# EAGLE design TheRug (EAGLE 7.7.0)
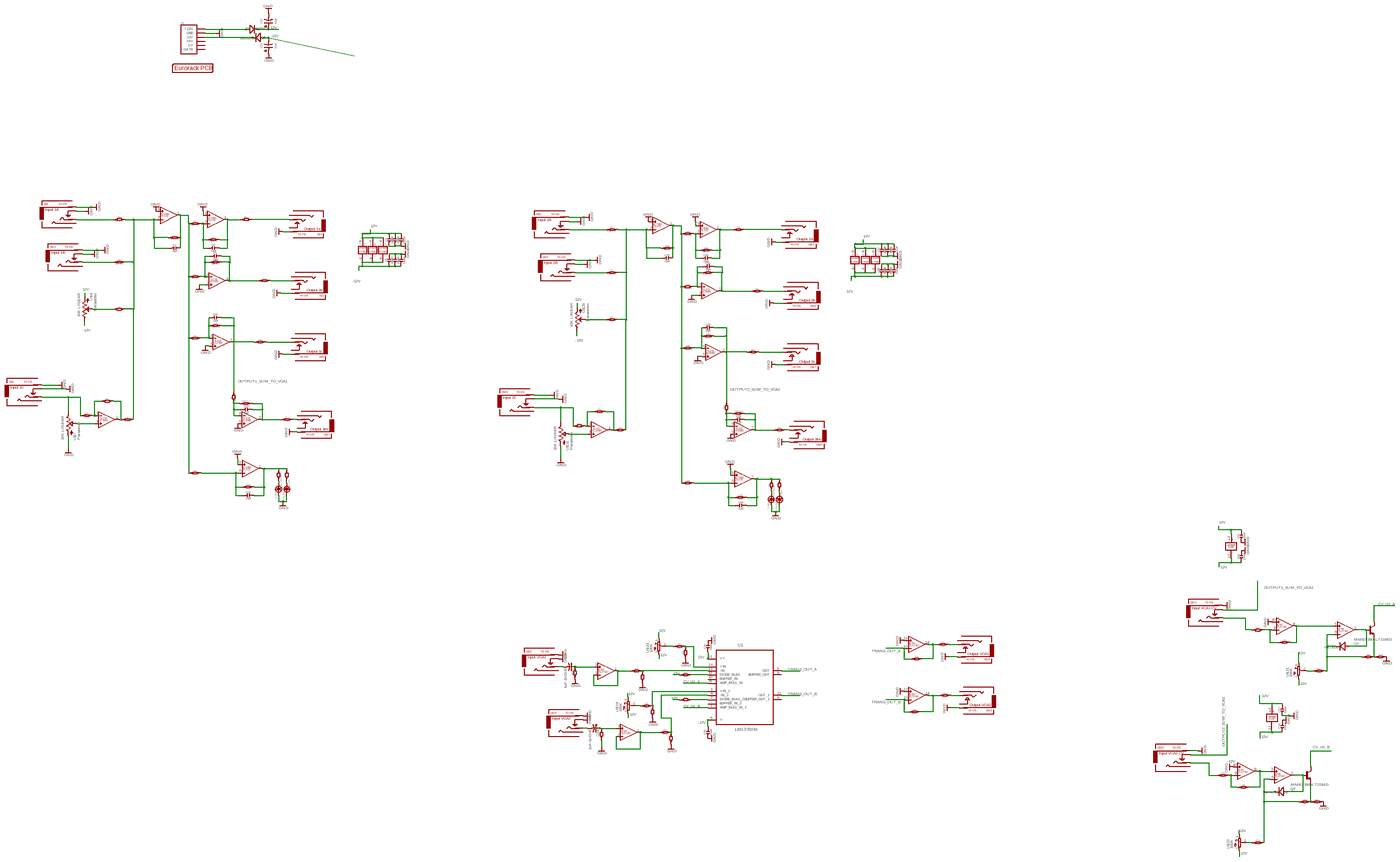
[diagram p0: schematic, sheet 1, overview]
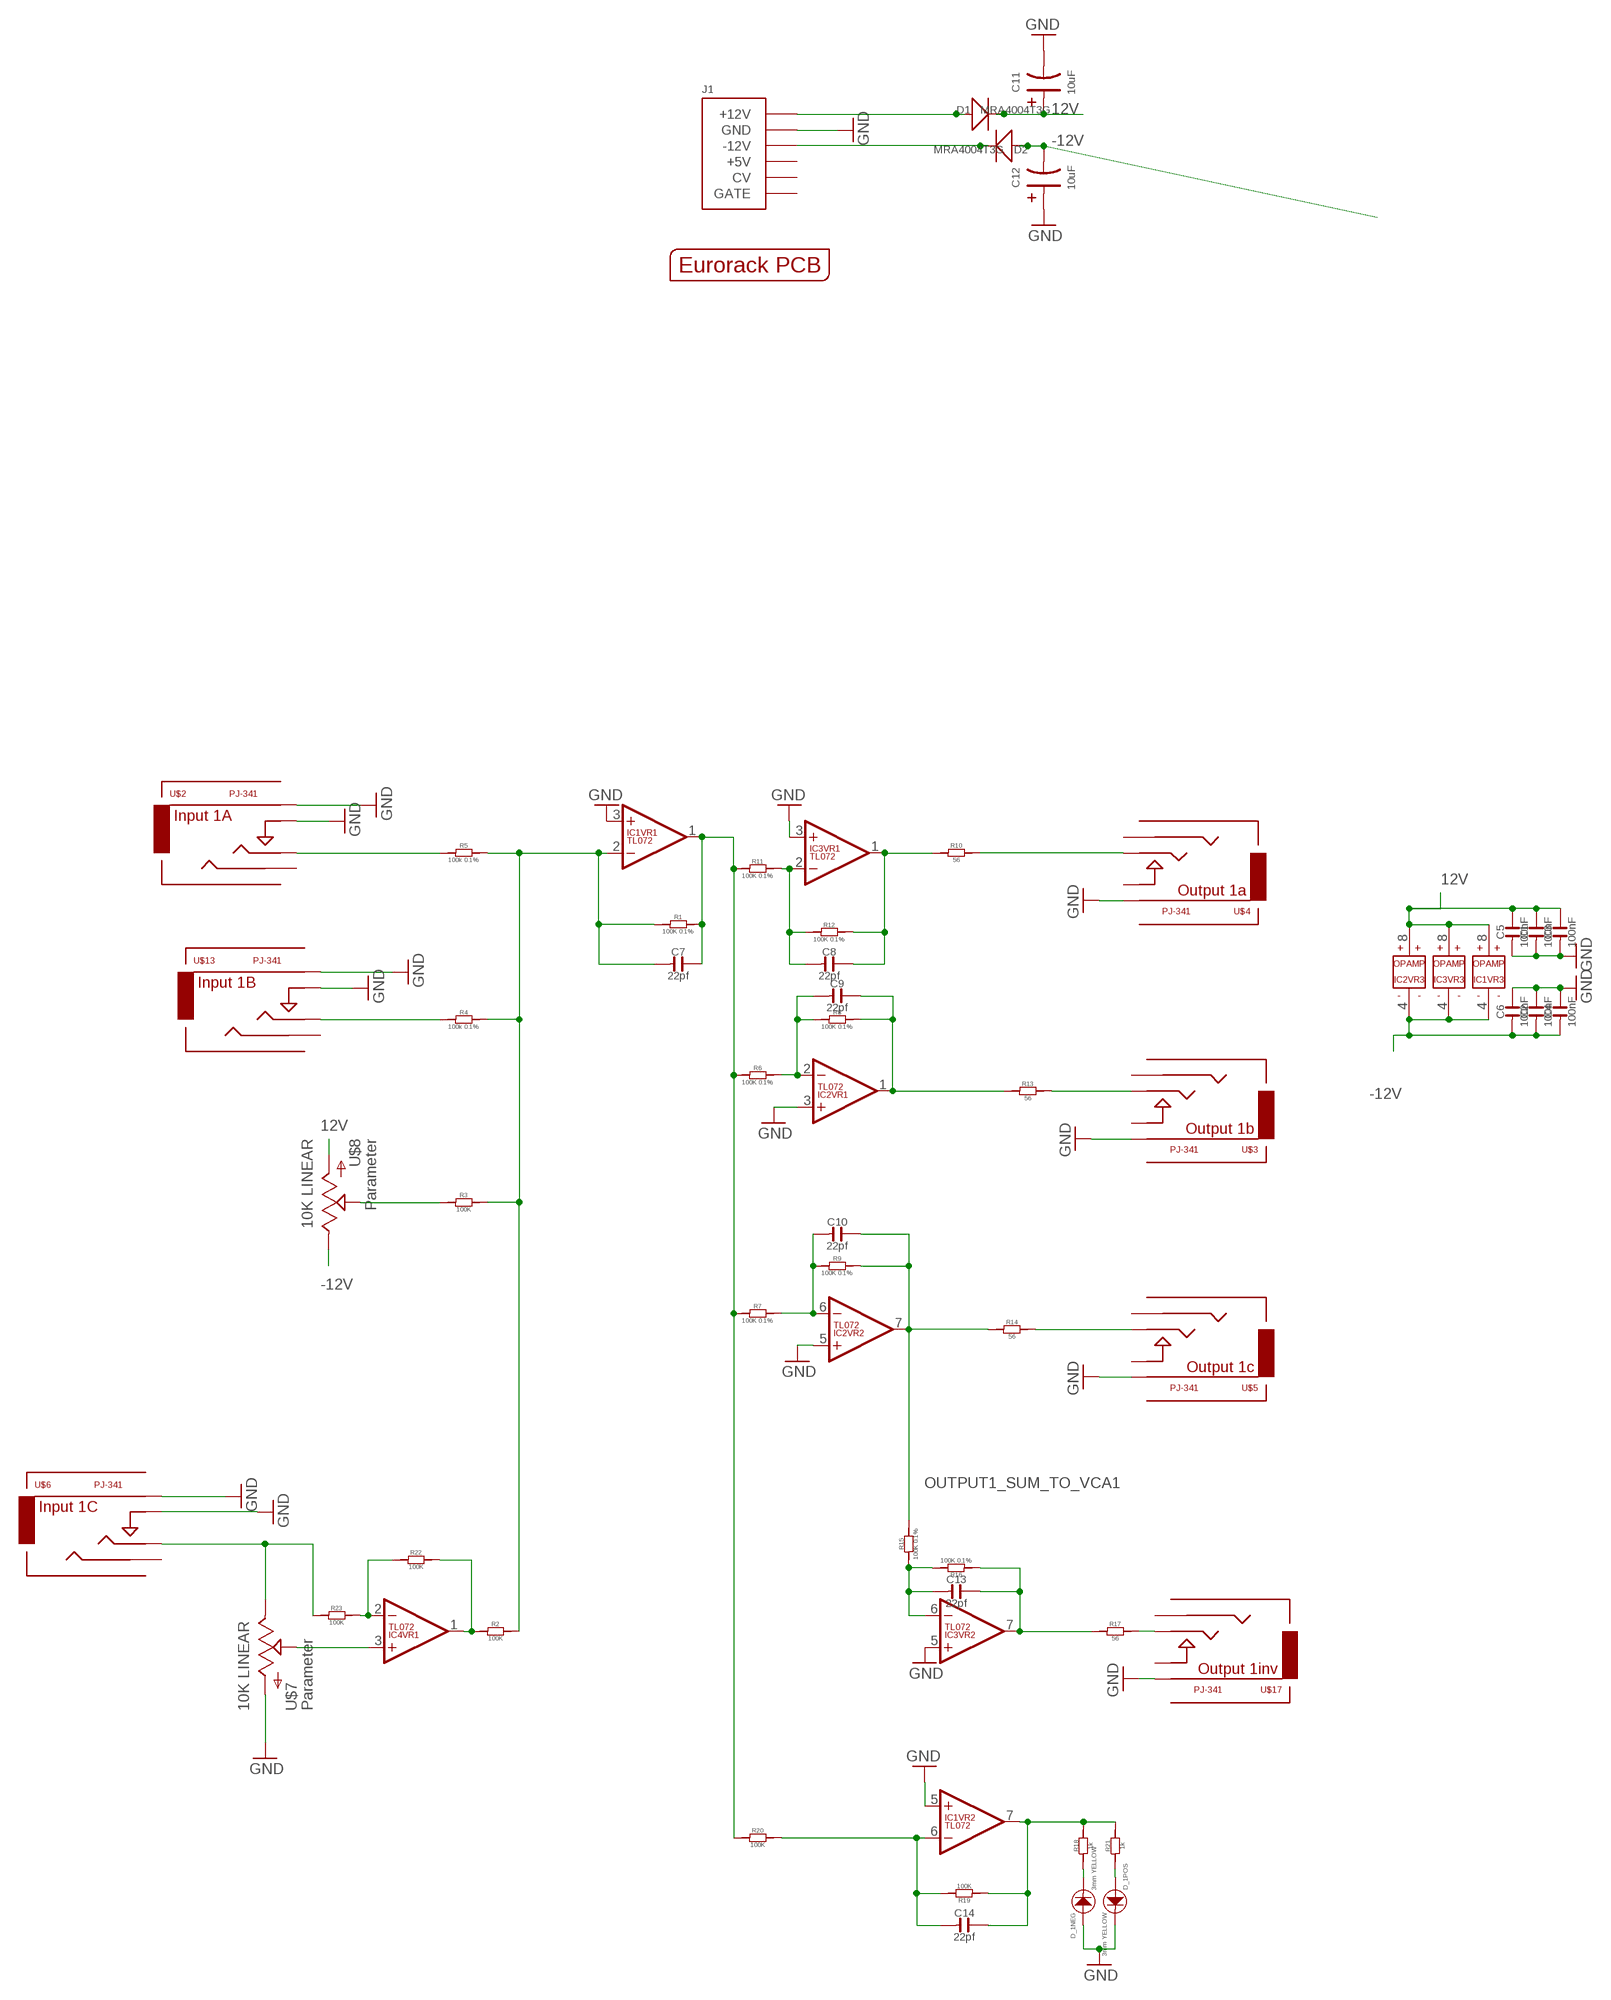
[diagram p1: schematic, sheet 1, part 1 of 4]
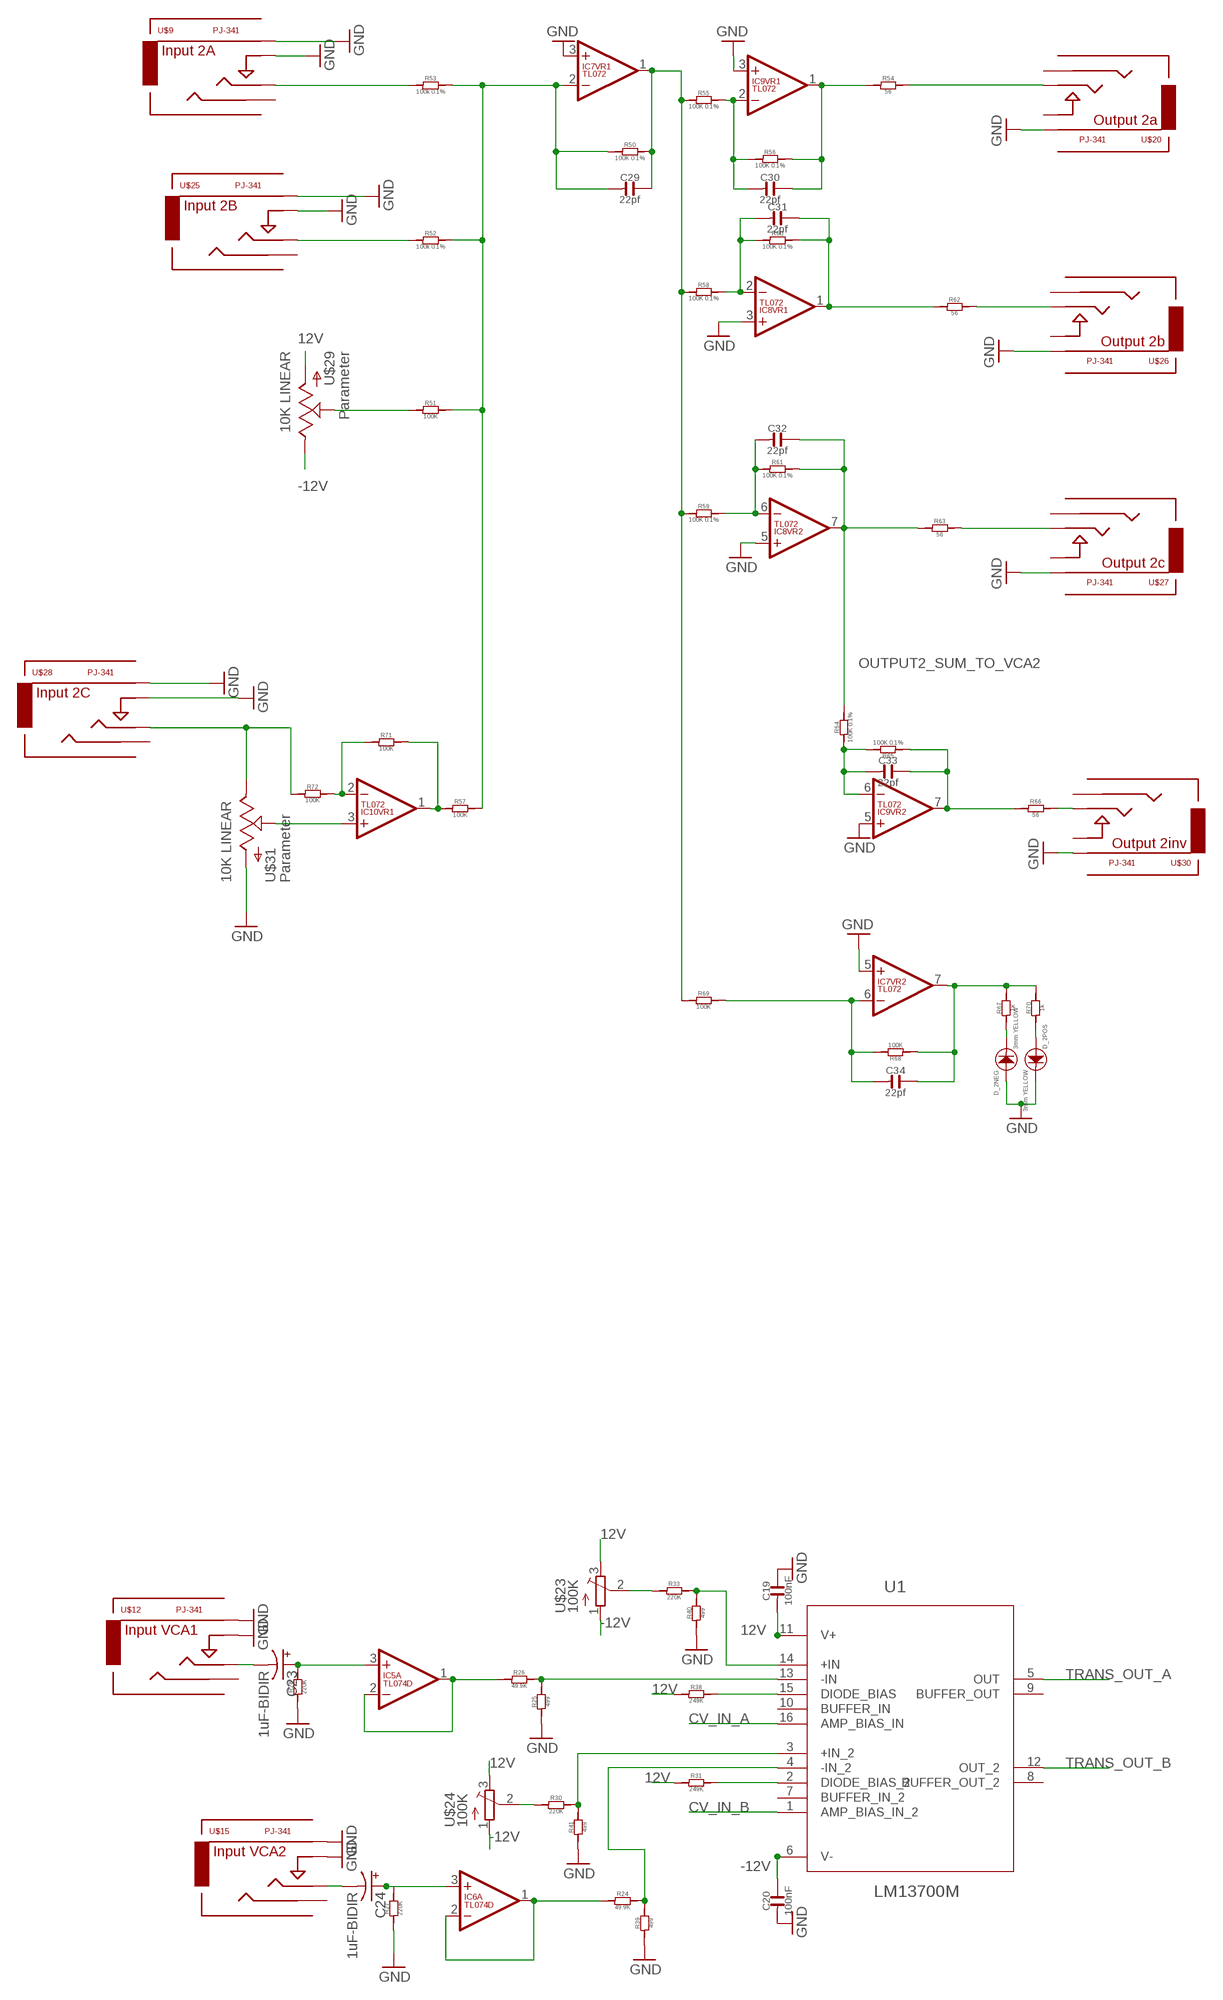
[diagram p2: schematic, sheet 1, part 2 of 4]
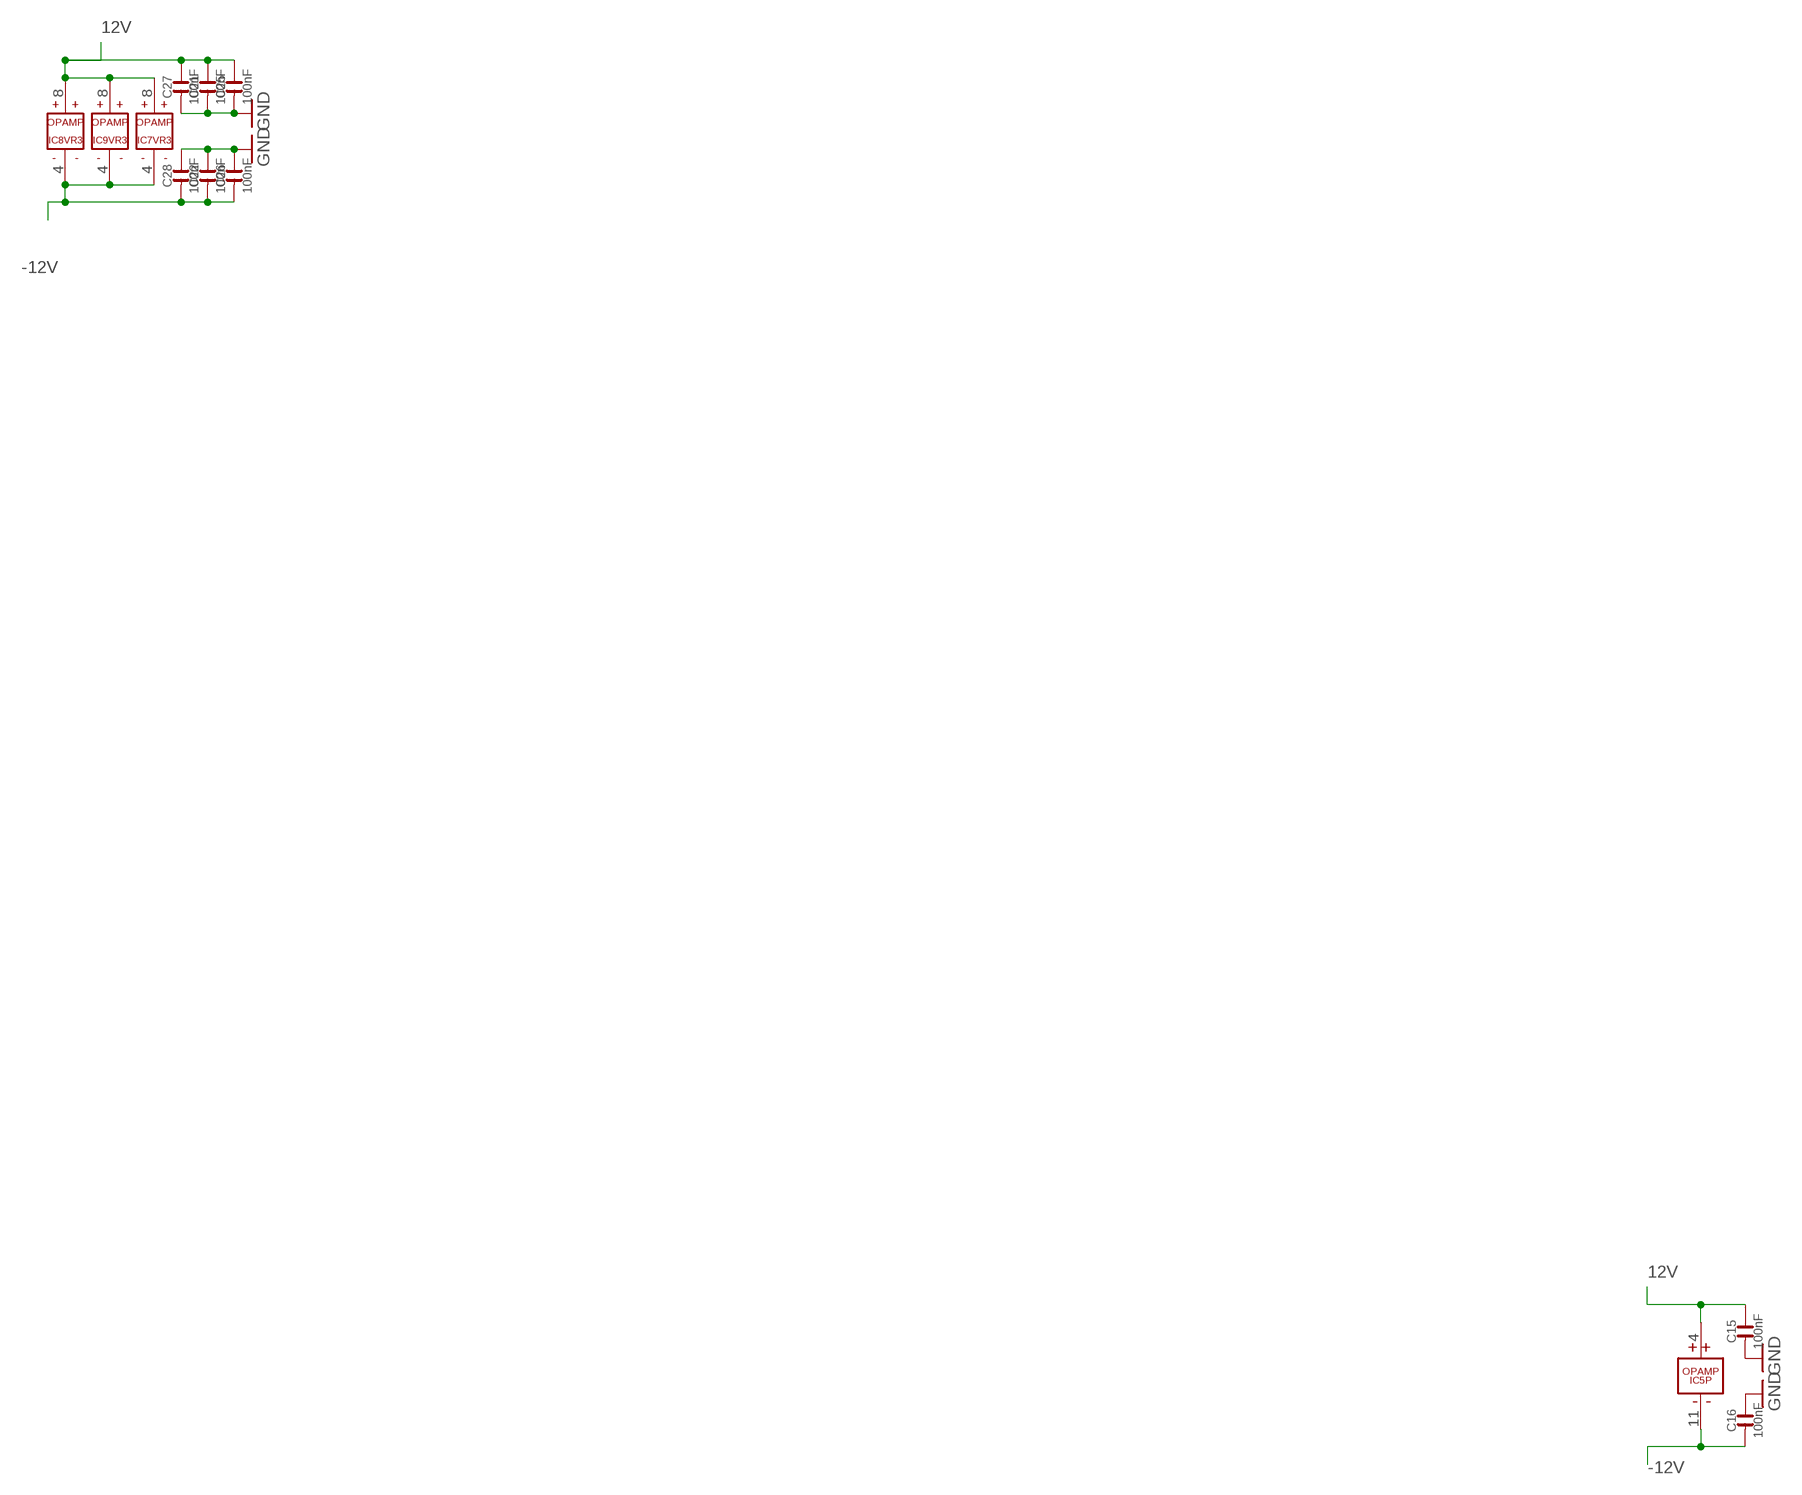
[diagram p3: schematic, sheet 1, part 3 of 4]
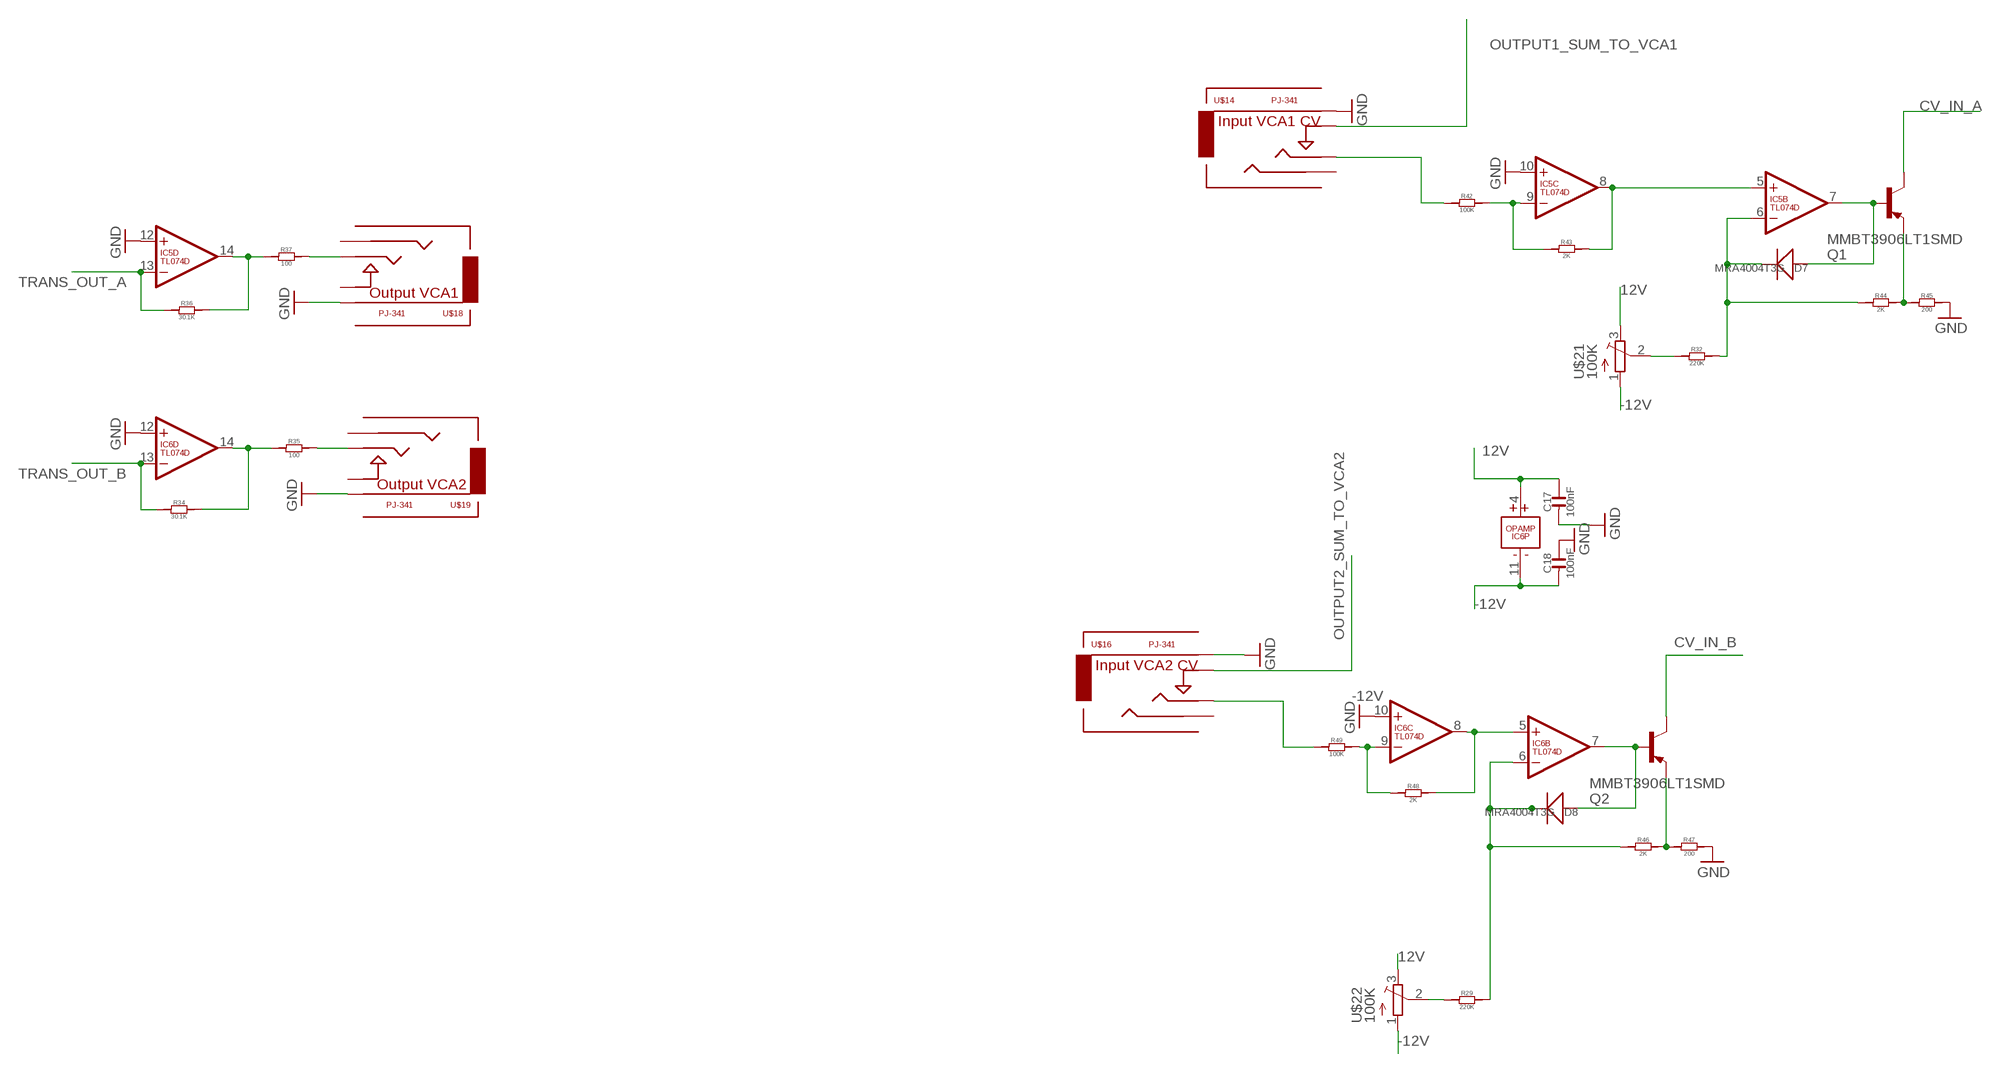
[diagram p4: schematic, sheet 1, part 4 of 4]

## Parts
C1  100nF  C-0603  [C0603]
C2  100nF  C-0603  [C0603]
C3  100nF  C-0603  [C0603]
C4  100nF  C-0603  [C0603]
C5  100nF  C-0603  [C0603]
C6  100nF  C-0603  [C0603]
C7  22pf  C-0603  [C0603]
C8  22pf  C-0603  [C0603]
C9  22pf  C-0603  [C0603]
C10  22pf  C-0603  [C0603]
C11  10uF  C-POLAR-A  [CASE-A_3216]
C12  10uF  C-POLAR-A  [CASE-A_3216]
C13  22pf  C-0603  [C0603]
C14  22pf  C-0603  [C0603]
C15  100nF  C-0603  [C0603]
C16  100nF  C-0603  [C0603]
C17  100nF  C-0603  [C0603]
C18  100nF  C-0603  [C0603]
C19  100nF  C-0603  [C0603]
C20  100nF  C-0603  [C0603]
C21  100nF  C-0603  [C0603]
C22  100nF  C-0603  [C0603]
C23  1uF-BIDIR  CPOL-US153CLV-0505  [153CLV-0505]
C24  1uF-BIDIR  CPOL-US153CLV-0505  [153CLV-0505]
C25  100nF  C-0603  [C0603]
C26  100nF  C-0603  [C0603]
C27  100nF  C-0603  [C0603]
C28  100nF  C-0603  [C0603]
C29  22pf  C-0603  [C0603]
C30  22pf  C-0603  [C0603]
C31  22pf  C-0603  [C0603]
C32  22pf  C-0603  [C0603]
C33  22pf  C-0603  [C0603]
C34  22pf  C-0603  [C0603]
D1  MRA4004T3G  D-SMA  [DO-214AC]
D2  MRA4004T3G  D-SMA  [DO-214AC]
D7  MRA4004T3G  D-SMA  [DO-214AC]
D8  MRA4004T3G  D-SMA  [DO-214AC]
D_1NEG  3mm YELLOW  LED3MM  [3MMLED]
D_1POS  3mm YELLOW  LED3MM  [3MMLED]
D_2NEG  3mm YELLOW  LED3MM  [3MMLED]
D_2POS  3mm YELLOW  LED3MM  [3MMLED]
IC1  TL072  [SO08]
IC2  TL072  [SO08]
IC3  TL072  [SO08]
IC4  TL072  [SO08]
IC5  TL074D  [SO14]
IC6  TL074D  [SO14]
IC7  TL072  [SO08]
IC8  TL072  [SO08]
IC9  TL072  [SO08]
IC10  TL072  [SO08]
J1  POWERSHROUDED  [POWER_16_SHROUDED]
Q1  MMBT3906LT1SMD  [SOT23-BEC]
Q2  MMBT3906LT1SMD  [SOT23-BEC]
R1  100K 0.1%  R-0603  [R0603]
R2  100K  R-0603  [R0603]
R3  100K  R-0603  [R0603]
R4  100k 0.1%  R-0603  [R0603]
R5  100k 0.1%  R-0603  [R0603]
R6  100K 0.1%  R-0603  [R0603]
R7  100K 0.1%  R-0603  [R0603]
R8  100K 0.1%  R-0603  [R0603]
R9  100K 0.1%  R-0603  [R0603]
R10  56  R-0603  [R0603]
R11  100K 0.1%  R-0603  [R0603]
R12  100K 0.1%  R-0603  [R0603]
R13  56  R-0603  [R0603]
R14  56  R-0603  [R0603]
R15  100K 0.1%  R-0603  [R0603]
R16  100K 0.1%  R-0603  [R0603]
R17  56  R-0603  [R0603]
R18  1k  R-0603  [R0603]
R19  100K  R-0603  [R0603]
R20  100K  R-0603  [R0603]
R21  1k  R-0603  [R0603]
R22  100K  R-0603  [R0603]
R23  100K  R-0603  [R0603]
R24  49.9K  R  [C0805]
R25  499  R  [C0805]
R26  49.9K  R  [C0805]
R27  220K  R  [C0805]
R28  220K  R  [C0805]
R29  220K  R  [C0805]
R30  220K  R  [C0805]
R31  249K  R  [C0805]
R32  220K  R  [C0805]
R33  220K  R  [C0805]
R34  30.1K  R  [C0805]
R35  100  R  [C0805]
R36  30.1K  R  [C0805]
R37  100  R  [C0805]
R38  249K  R  [C0805]
R39  499  R  [C0805]
R40  499  R  [C0805]
R41  499  R  [C0805]
R42  100K  R  [C0805]
R43  2K  R  [C0805]
R44  2K  R  [C0805]
R45  200  R  [C0805]
R46  2K  R  [C0805]
R47  200  R  [C0805]
R48  2K  R  [C0805]
R49  100K  R  [C0805]
R50  100K 0.1%  R-0603  [R0603]
R51  100K  R-0603  [R0603]
R52  100k 0.1%  R-0603  [R0603]
R53  100k 0.1%  R-0603  [R0603]
R54  56  R-0603  [R0603]
R55  100K 0.1%  R-0603  [R0603]
R56  100K 0.1%  R-0603  [R0603]
R57  100K  R-0603  [R0603]
R58  100K 0.1%  R-0603  [R0603]
R59  100K 0.1%  R-0603  [R0603]
R60  100K 0.1%  R-0603  [R0603]
R61  100K 0.1%  R-0603  [R0603]
R62  56  R-0603  [R0603]
R63  56  R-0603  [R0603]
R64  100K 0.1%  R-0603  [R0603]
R65  100K 0.1%  R-0603  [R0603]
R66  56  R-0603  [R0603]
R67  1k  R-0603  [R0603]
R68  100K  R-0603  [R0603]
R69  100K  R-0603  [R0603]
R70  1k  R-0603  [R0603]
R71  100K  R-0603  [R0603]
R72  100K  R-0603  [R0603]
U1  LM13700M  [SOIC127P620X175-16N]
U$1  EURORACK_PCB12HP  [EURORACK12HPPCB]
U$2  PJ-341  AUDIO-JACKINPUT  [3.5MM-JACK-SWITCH-13MM-INPUT]
U$3  PJ-341  AUDIO-JACKOUTPUT  [3.5MM-JACK-SWITCH-13MM-OUTPUT]
U$4  PJ-341  AUDIO-JACKOUTPUT  [3.5MM-JACK-SWITCH-13MM-OUTPUT]
U$5  PJ-341  AUDIO-JACKOUTPUT  [3.5MM-JACK-SWITCH-13MM-OUTPUT]
U$6  PJ-341  AUDIO-JACKINPUT  [3.5MM-JACK-SWITCH-13MM-INPUT]
U$7  10K LINEAR  POTZEPHPOT  [OG-POTS_ALPS_POT_VERTICAL]
U$8  10K LINEAR  POTZEPHPOT  [OG-POTS_ALPS_POT_VERTICAL]
U$9  PJ-341  AUDIO-JACKINPUT  [3.5MM-JACK-SWITCH-13MM-INPUT]
U$12  PJ-341  AUDIO-JACKINPUT  [3.5MM-JACK-SWITCH-13MM-INPUT]
U$13  PJ-341  AUDIO-JACKINPUT  [3.5MM-JACK-SWITCH-13MM-INPUT]
U$14  PJ-341  AUDIO-JACKINPUT  [3.5MM-JACK-SWITCH-13MM-INPUT]
U$15  PJ-341  AUDIO-JACKINPUT  [3.5MM-JACK-SWITCH-13MM-INPUT]
U$16  PJ-341  AUDIO-JACKINPUT  [3.5MM-JACK-SWITCH-13MM-INPUT]
U$17  PJ-341  AUDIO-JACKOUTPUT  [3.5MM-JACK-SWITCH-13MM-OUTPUT]
U$18  PJ-341  AUDIO-JACKOUTPUT  [3.5MM-JACK-SWITCH-13MM-OUTPUT]
U$19  PJ-341  AUDIO-JACKOUTPUT  [3.5MM-JACK-SWITCH-13MM-OUTPUT]
U$20  PJ-341  AUDIO-JACKOUTPUT  [3.5MM-JACK-SWITCH-13MM-OUTPUT]
U$21  100K  TRIMPOTTC33X  [TC33X]
U$22  100K  TRIMPOTTC33X  [TC33X]
U$23  100K  TRIMPOTTC33X  [TC33X]
U$24  100K  TRIMPOTTC33X  [TC33X]
U$25  PJ-341  AUDIO-JACKINPUT  [3.5MM-JACK-SWITCH-13MM-INPUT]
U$26  PJ-341  AUDIO-JACKOUTPUT  [3.5MM-JACK-SWITCH-13MM-OUTPUT]
U$27  PJ-341  AUDIO-JACKOUTPUT  [3.5MM-JACK-SWITCH-13MM-OUTPUT]
U$28  PJ-341  AUDIO-JACKINPUT  [3.5MM-JACK-SWITCH-13MM-INPUT]
U$29  10K LINEAR  POTZEPHPOT  [OG-POTS_ALPS_POT_VERTICAL]
U$30  PJ-341  AUDIO-JACKOUTPUT  [3.5MM-JACK-SWITCH-13MM-OUTPUT]
U$31  10K LINEAR  POTZEPHPOT  [OG-POTS_ALPS_POT_VERTICAL]

## Nets
12V: C1.2 C3.2 C5.2 C11.+ C15.2 C17.2 C19.1 C21.2 C25.2 C27.2 D1.2(-) IC1.8(VR3:V+) IC2.8(VR3:V+) IC3.8(VR3:V+) IC5.4(P:V+) IC6.4(P:V+) IC7.8(VR3:V+) IC8.8(VR3:V+) IC9.8(VR3:V+) R31.1 R38.1 U1.11(V+) U$8.P$3(A) U$21.3(E) U$22.3(E) U$23.3(E) U$24.3(E) U$29.P$3(A)
-12V: C2.1 C4.1 C6.1 C12.- C16.1 C18.1 C20.2 C22.1 C26.1 C28.1 D2.1(+) IC1.4(VR3:V-) IC2.4(VR3:V-) IC3.4(VR3:V-) IC5.11(P:V-) IC6.11(P:V-) IC7.4(VR3:V-) IC8.4(VR3:V-) IC9.4(VR3:V-) U1.6(V-) U$8.P$1(E) U$21.1(A) U$22.1(A) U$23.1(A) U$24.1(A) U$29.P$1(E)
CV_IN_A: Q1.C U1.16(AMP_BIAS_IN)
CV_IN_B: Q2.C U1.1(AMP_BIAS_IN_2)
GND: C1.1 C2.2 C3.1 C4.2 C5.1 C6.2 C11.- C12.+ C15.1 C16.2 C17.1 C18.2 C19.2 C20.1 C21.1 C22.2 C25.1 C26.2 C27.1 C28.2 D_1NEG.+ D_1POS.- D_2NEG.+ D_2POS.- IC1.3(VR1:+IN) IC1.5(VR2:+IN) IC2.3(VR1:+IN) IC2.5(VR2:+IN) IC3.3(VR1:+IN) IC3.5(VR2:+IN) IC5.10(C:+IN) IC5.12(D:+IN) IC6.10(C:+IN) IC6.12(D:+IN) IC7.3(VR1:+IN) IC7.5(VR2:+IN) IC8.3(VR1:+IN) IC8.5(VR2:+IN) IC9.3(VR1:+IN) IC9.5(VR2:+IN) J1.3(GND) J1.4(GND) J1.5(GND) J1.6(GND) J1.7(GND) J1.8(GND) R25.1 R27.1 R28.1 R39.1 R40.1 R41.1 R45.2 R47.2 U$2.RING@3(RING) U$2.SWITCH@3(SWITCH) U$3.RING@3(RING) U$4.RING@3(RING) U$5.RING@3(RING) U$6.RING@3(RING) U$6.SWITCH@3(SWITCH) U$7.P$3(A) U$9.RING@3(RING) U$9.SWITCH@3(SWITCH) U$12.RING@3(RING) U$12.SWITCH@3(SWITCH) U$13.RING@3(RING) U$13.SWITCH@3(SWITCH) U$14.RING@3(RING) U$15.RING@3(RING) U$15.SWITCH@3(SWITCH) U$16.RING@3(RING) U$17.RING@3(RING) U$18.RING@3(RING) U$19.RING@3(RING) U$20.RING@3(RING) U$25.RING@3(RING) U$25.SWITCH@3(SWITCH) U$26.RING@3(RING) U$27.RING@3(RING) U$28.RING@3(RING) U$28.SWITCH@3(SWITCH) U$30.RING@3(RING) U$31.P$3(A)
N$1: IC4.3(VR1:+IN) U$7.P$2(S)
N$2: C8.2 IC3.1(VR1:OUT) R10.1 R12.2
N$3: IC4.1(VR1:OUT) R2.1 R22.2
N$4: R23.1 U$6.TIP@3(TIP) U$7.P$1(E)
N$5: C9.1 IC2.2(VR1:-IN) R6.2 R8.1
N$6: R3.1 U$8.P$2(S)
N$7: C7.2 IC1.1(VR1:OUT) R1.2 R6.1 R7.1 R11.1 R20.1
N$8: C8.1 IC3.2(VR1:-IN) R11.2 R12.1
N$9: C10.1 IC2.6(VR2:-IN) R7.2 R9.1
N$10: IC4.2(VR1:-IN) R22.1 R23.2
N$11: C9.2 IC2.1(VR1:OUT) R8.2 R13.1
N$12: R4.1 U$13.TIP@3(TIP)
N$14: C7.1 IC1.2(VR1:-IN) R1.1 R2.2 R3.2 R4.2 R5.2
N$15: R13.2 U$3.TIP@3(TIP)
N$16: R14.2 U$5.TIP@3(TIP)
N$17: C13.1 IC3.6(VR2:-IN) R15.1 R16.2
N$18: C13.2 IC3.7(VR2:OUT) R16.1 R17.1
N$19: R17.2 U$17.TIP@3(TIP)
N$20: R5.1 U$2.TIP@3(TIP)
N$21: D_1POS.+ R21.1
N$22: R10.2 U$4.TIP@3(TIP)
N$23: D_1NEG.- R18.1
N$24: C14.2 IC1.7(VR2:OUT) R18.2 R19.1 R21.2
N$25: C14.1 IC1.6(VR2:-IN) R19.2 R20.2
N$26: R37.2 U$18.TIP@3(TIP)
N$27: IC5.14(D:OUT) R36.2 R37.1
N$28 [heavypower]: D1.1(+) J1.9(+12V) J1.10(+12V)
N$29: R31.2 U1.2(DIODE_BIAS_2)
N$30: R38.2 U1.15(DIODE_BIAS)
N$31: R35.2 U$19.TIP@3(TIP)
N$32: IC6.14(D:OUT) R34.2 R35.1
N$33: R33.1 U$23.2(S)
N$34: R32.1 U$21.2(S)
N$35: R30.1 U$24.2(S)
N$36: R29.1 U$22.2(S)
N$37: C23.- U$12.TIP@3(TIP)
N$38: C24.- U$15.TIP@3(TIP)
N$39: C23.+ IC5.3(A:+IN) R28.2
N$40: C24.+ IC6.3(A:+IN) R27.2
N$41: IC5.1(A:OUT) IC5.2(A:-IN) R26.1
N$42: IC6.1(A:OUT) IC6.2(A:-IN) R24.1
N$43: R25.2 R26.2 U1.13(-IN)
N$44: R24.2 R39.2 U1.4(-IN_2)
N$45: R33.2 R40.2 U1.14(+IN)
N$46: R30.2 R41.2 U1.3(+IN_2)
N$47: R49.1 U$16.TIP@3(TIP)
N$48: R42.1 U$14.TIP@3(TIP)
N$50: IC5.9(C:-IN) R42.2 R43.1
N$51: IC5.5(B:+IN) IC5.8(C:OUT) R43.2
N$52: D7.2(-) IC5.6(B:-IN) R32.2 R44.1
N$53: C30.2 IC9.1(VR1:OUT) R54.1 R56.2
N$54: R51.1 U$29.P$2(S)
N$55: D7.1(+) IC5.7(B:OUT) Q1.B
N$56: Q1.E R44.2 R45.1
N$57: D8.2(-) IC6.6(B:-IN) R29.2 R46.1
N$58: D8.1(+) IC6.7(B:OUT) Q2.B
N$59: Q2.E R46.2 R47.1
N$60: IC6.5(B:+IN) IC6.8(C:OUT) R48.2
N$62: IC6.9(C:-IN) R48.1 R49.2
N$63: R52.1 U$25.TIP@3(TIP)
N$64 [heavypower]: D2.2(-) J1.1(-12V) J1.2(-12V)
N$65: C29.1 IC7.2(VR1:-IN) R50.1 R51.2 R52.2 R53.2 R57.2
N$66: R54.2 U$20.TIP@3(TIP)
N$67: C29.2 IC7.1(VR1:OUT) R50.2 R55.1 R58.1 R59.1 R69.1
N$68: C30.1 IC9.2(VR1:-IN) R55.2 R56.1
N$69: R53.1 U$9.TIP@3(TIP)
N$70: R72.1 U$28.TIP@3(TIP) U$31.P$1(E)
N$71: C31.1 IC8.2(VR1:-IN) R58.2 R60.1
N$72: C32.1 IC8.6(VR2:-IN) R59.2 R61.1
N$73: C31.2 IC8.1(VR1:OUT) R60.2 R62.1
N$75: R62.2 U$26.TIP@3(TIP)
N$76: R63.2 U$27.TIP@3(TIP)
N$77: C33.1 IC9.6(VR2:-IN) R64.1 R65.2
N$78: C33.2 IC9.7(VR2:OUT) R65.1 R66.1
N$79: R66.2 U$30.TIP@3(TIP)
N$80: D_2NEG.- R67.1
N$81: C34.2 IC7.7(VR2:OUT) R67.2 R68.1 R70.2
N$82: C34.1 IC7.6(VR2:-IN) R68.2 R69.2
N$83: D_2POS.+ R70.1
N$84: IC10.3(VR1:+IN) U$31.P$2(S)
N$85: IC10.1(VR1:OUT) R57.1 R71.2
N$86: IC10.2(VR1:-IN) R71.1 R72.2
OUTPUT1_SUM_TO_VCA1: C10.2 IC2.7(VR2:OUT) R9.2 R14.1 R15.2 U$14.SWITCH@3(SWITCH)
OUTPUT2_SUM_TO_VCA2: C32.2 IC8.7(VR2:OUT) R61.2 R63.1 R64.2 U$16.SWITCH@3(SWITCH)
TRANS_OUT_A: IC5.13(D:-IN) R36.1 U1.5(OUT)
TRANS_OUT_B: IC6.13(D:-IN) R34.1 U1.12(OUT_2)
Unconnected: IC4.5(VR2:+IN) IC4.6(VR2:-IN) IC4.7(VR2:OUT) IC10.5(VR2:+IN) IC10.6(VR2:-IN) IC10.7(VR2:OUT) J1.11(+5V) J1.12(+5V) J1.13(CV) J1.14(CV) J1.15(GATE) J1.16(GATE) U1.7(BUFFER_IN_2) U1.8(BUFFER_OUT_2) U1.9(BUFFER_OUT) U1.10(BUFFER_IN) U$2.SECOND@3(SECOND) U$3.SECOND@3(SECOND) U$3.SWITCH@3(SWITCH) U$4.SECOND@3(SECOND) U$4.SWITCH@3(SWITCH) U$5.SECOND@3(SECOND) U$5.SWITCH@3(SWITCH) U$6.SECOND@3(SECOND) U$9.SECOND@3(SECOND) U$12.SECOND@3(SECOND) U$13.SECOND@3(SECOND) U$14.SECOND@3(SECOND) U$15.SECOND@3(SECOND) U$16.SECOND@3(SECOND) U$17.SECOND@3(SECOND) U$17.SWITCH@3(SWITCH) U$18.SECOND@3(SECOND) U$18.SWITCH@3(SWITCH) U$19.SECOND@3(SECOND) U$19.SWITCH@3(SWITCH) U$20.SECOND@3(SECOND) U$20.SWITCH@3(SWITCH) U$25.SECOND@3(SECOND) U$26.SECOND@3(SECOND) U$26.SWITCH@3(SWITCH) U$27.SECOND@3(SECOND) U$27.SWITCH@3(SWITCH) U$28.SECOND@3(SECOND) U$30.SECOND@3(SECOND) U$30.SWITCH@3(SWITCH)

## Power pins joined to a net without a drawn wire
V+: IC4.8(VR3:V+) IC10.8(VR3:V+)
V-: IC4.4(VR3:V-) IC10.4(VR3:V-)

## Library data of the parts
C1-C10 C13-C22 C25-C34 = OPL:C*
C11 C12 = EurorackModularParts:C-POLAR*
C23 C24 = adafruit:CPOL-US: POLARIZED CAPACITOR, American symbol
D1 D2 D7 D8 = OPL:D*: DIODE; MF: VISHAY; MPN: US1G-E3/5AT; OC_FARNELL: 9551824
D_1NEG D_1POS D_2NEG D_2POS = EurorackModularParts:LED*: LED
IC1-IC4 IC7-IC10 = EurorackModularParts:TL072
IC5 IC6 = EurorackModularParts:TL074: OP AMP
J1 = EurorackModularParts:POWER
Q1 Q2 = transistor-pnp:MMBT3906*: PNP Transistror
R1-R72 = OPL:R*
U1 = FarnellThings:LM13700M: Dual Operational Transconductance Amplifiers; MPN: LM13700M; OC_FARNELL: 1468910; OC_NEWARK: 41K3505; PACKAGE: SOIC-16; SUPPLIER: National Semiconductor
U$1 = EurorackModularParts:EURORACK_PCB
U$2 = EurorackModularParts:AUDIO-JACK: Switching Mono 3.5mm Audio Jack from Erthenvar.; DESC: Input 1A; MPN: PJ-341
U$3 = EurorackModularParts:AUDIO-JACK: Switching Mono 3.5mm Audio Jack from Erthenvar.; DESC: Output 1b; MPN: PJ-341
U$4 = EurorackModularParts:AUDIO-JACK: Switching Mono 3.5mm Audio Jack from Erthenvar.; DESC: Output 1a; MPN: PJ-341
U$5 = EurorackModularParts:AUDIO-JACK: Switching Mono 3.5mm Audio Jack from Erthenvar.; DESC: Output 1c; MPN: PJ-341
U$6 = EurorackModularParts:AUDIO-JACK: Switching Mono 3.5mm Audio Jack from Erthenvar.; DESC: Input 1C; MPN: PJ-341
U$7 U$8 U$29 U$31 = EurorackModularParts:POT; DESC: Parameter
U$9 = EurorackModularParts:AUDIO-JACK: Switching Mono 3.5mm Audio Jack from Erthenvar.; DESC: Input 2A; MPN: PJ-341
U$12 = EurorackModularParts:AUDIO-JACK: Switching Mono 3.5mm Audio Jack from Erthenvar.; DESC: Input VCA1; MPN: PJ-341
U$13 = EurorackModularParts:AUDIO-JACK: Switching Mono 3.5mm Audio Jack from Erthenvar.; DESC: Input 1B; MPN: PJ-341
U$14 = EurorackModularParts:AUDIO-JACK: Switching Mono 3.5mm Audio Jack from Erthenvar.; DESC: Input VCA1 CV; MPN: PJ-341
U$15 = EurorackModularParts:AUDIO-JACK: Switching Mono 3.5mm Audio Jack from Erthenvar.; DESC: Input VCA2; MPN: PJ-341
U$16 = EurorackModularParts:AUDIO-JACK: Switching Mono 3.5mm Audio Jack from Erthenvar.; DESC: Input VCA2 CV; MPN: PJ-341
U$17 = EurorackModularParts:AUDIO-JACK: Switching Mono 3.5mm Audio Jack from Erthenvar.; DESC: Output 1inv; MPN: PJ-341
U$18 = EurorackModularParts:AUDIO-JACK: Switching Mono 3.5mm Audio Jack from Erthenvar.; DESC: Output VCA1; MPN: PJ-341
U$19 = EurorackModularParts:AUDIO-JACK: Switching Mono 3.5mm Audio Jack from Erthenvar.; DESC: Output VCA2; MPN: PJ-341
U$20 = EurorackModularParts:AUDIO-JACK: Switching Mono 3.5mm Audio Jack from Erthenvar.; DESC: Output 2a; MPN: PJ-341
U$21-U$24 = adafruit:TRIMPOT: SMT trimmer potentiometer part number TC33X http://www.ladyada.net/library/eagle
U$25 = EurorackModularParts:AUDIO-JACK: Switching Mono 3.5mm Audio Jack from Erthenvar.; DESC: Input 2B; MPN: PJ-341
U$26 = EurorackModularParts:AUDIO-JACK: Switching Mono 3.5mm Audio Jack from Erthenvar.; DESC: Output 2b; MPN: PJ-341
U$27 = EurorackModularParts:AUDIO-JACK: Switching Mono 3.5mm Audio Jack from Erthenvar.; DESC: Output 2c; MPN: PJ-341
U$28 = EurorackModularParts:AUDIO-JACK: Switching Mono 3.5mm Audio Jack from Erthenvar.; DESC: Input 2C; MPN: PJ-341
U$30 = EurorackModularParts:AUDIO-JACK: Switching Mono 3.5mm Audio Jack from Erthenvar.; DESC: Output 2inv; MPN: PJ-341

## Net classes
0 default: width 0.254 mm
1 heavypower: width 0.381 mm

## Board
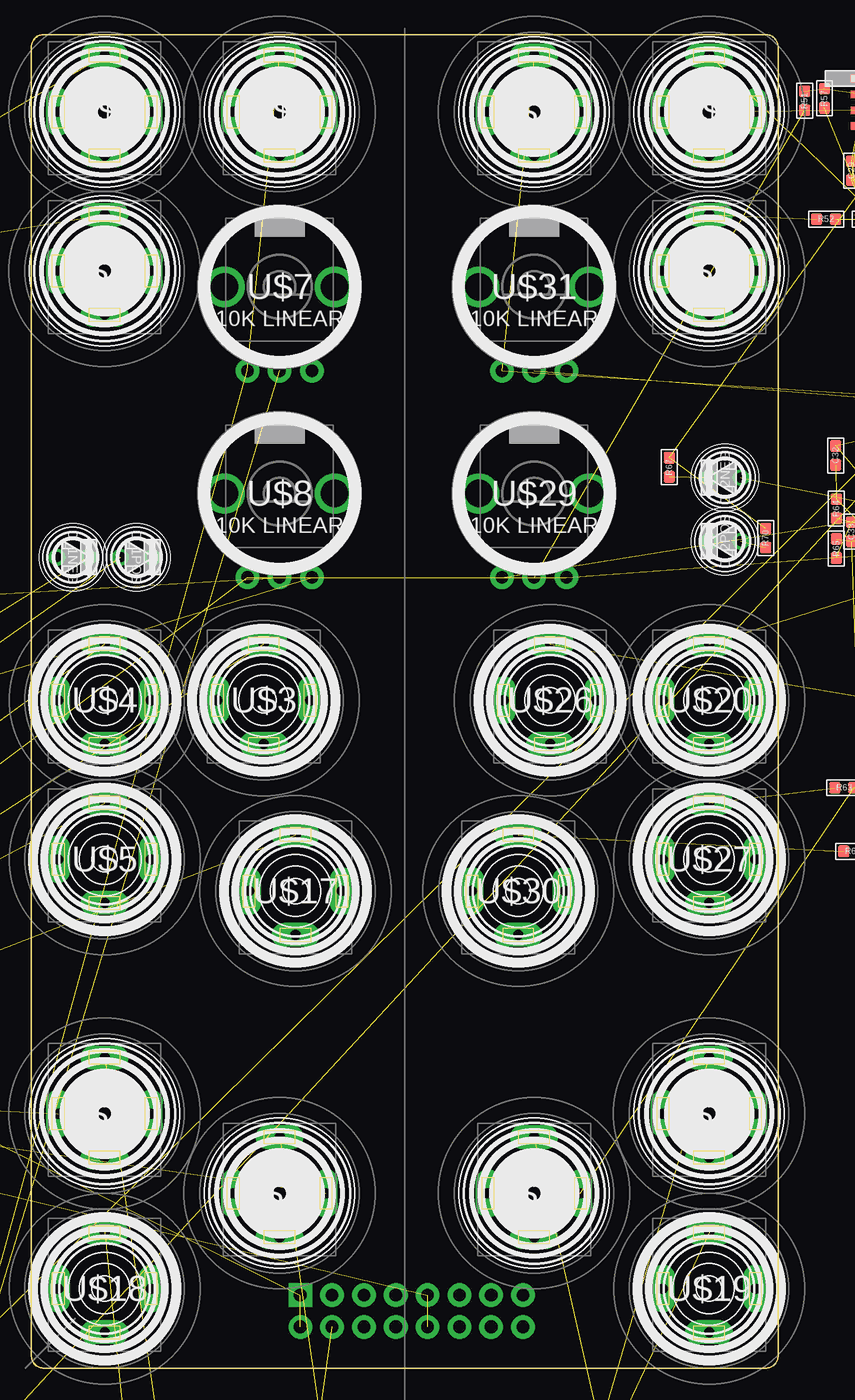
[diagram p5: board, top side]
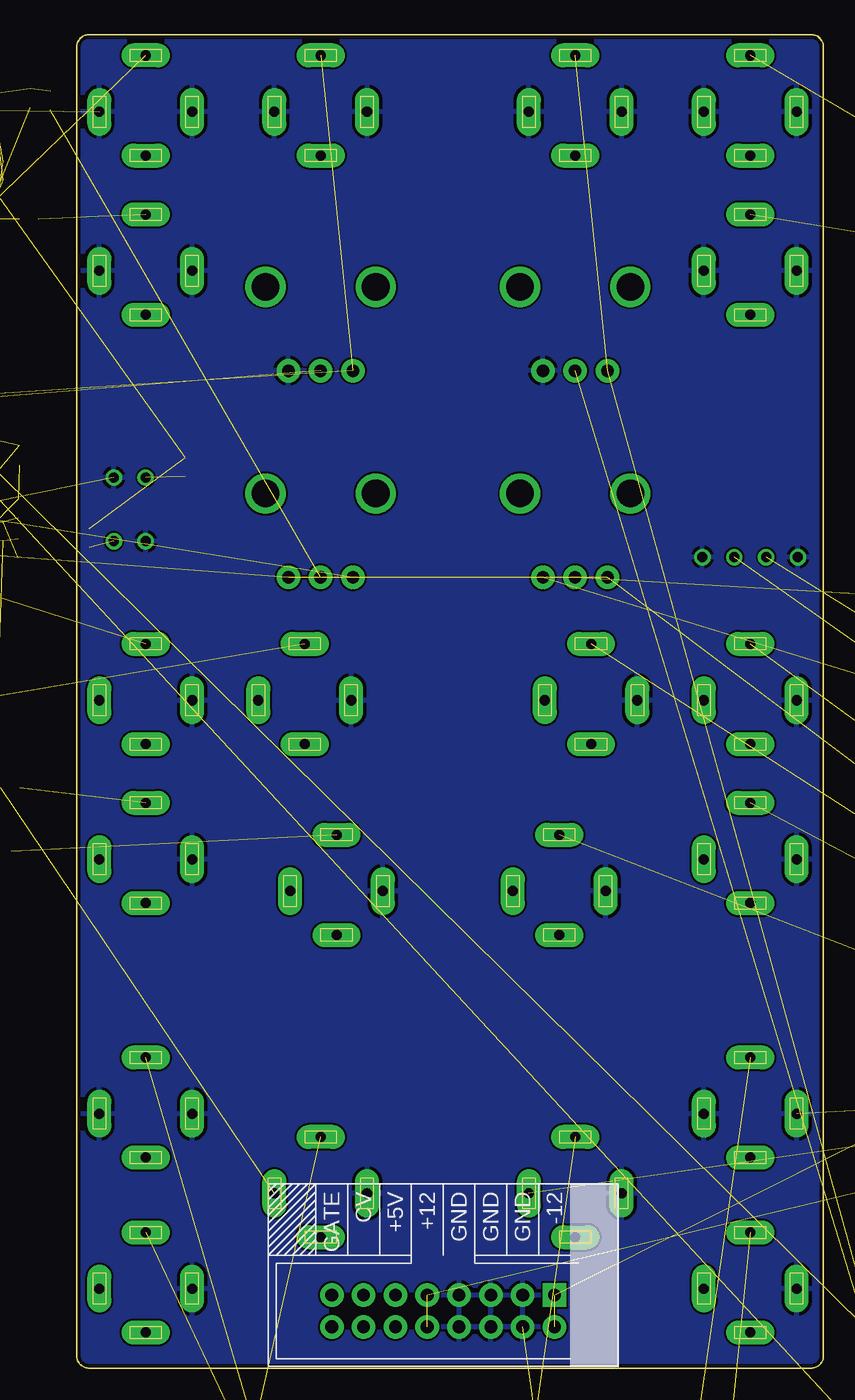
[diagram p6: board, bottom side, seen from below]

Size 59.62 x 106.5 mm. Coordinates in mm from the lower left corner, seen from the top.
Copper layers (1*16): Top 0.035mm / dielectric 1.5mm / Bottom 0.035mm
Design rules "ITEADstudio_DRC": minimum track width 6mil, minimum drill 12mil, track to track 6mil, track to pad 6mil, pad to pad 6mil, via to via 6mil, smd to smd 0mil, copper to edge 10mil, drill to drill 10mil, minimum pad ring 10mil, minimum via ring 6mil, stop-mask expansion 2mil, vias tented up to drill 100mil, thermal gap 10mil

### Footprints (pad centres in the part's own frame; a part is rotated, then mirrored left to right if it is on the bottom)
C0603 = smd 0.889 x 0.889: 1 -0.762,0; 2 0.762,0
CASE-A_3216 = smd 1.27 x 1.27: + -1.27,0; - 1.27,0
153CLV-0505 = smd 3 x 1.6: + 2.2,0; - -2.2,0
DO-214AC = smd 2.5 x 1.7: 1 -2,0; 2 2,0
3MMLED = drill 0.8: + -1.27,0; - 1.27,0
SO08 = smd 0.6 x 2.2: 1 -1.905,-2.6; 2 -0.635,-2.6; 3 0.635,-2.6; 4 1.905,-2.6; 5 1.905,2.6; 6 0.635,2.6; 7 -0.635,2.6; 8 -1.905,2.6
SO14 = smd 0.6 x 2.2: 1 -3.81,-2.6; 2 -2.54,-2.6; 3 -1.27,-2.6; 4 0,-2.6; 5 1.27,-2.6; 6 2.54,-2.6; 7 3.81,-2.6; 8 3.81,2.6; 9 2.54,2.6; 10 1.27,2.6; 11 0,2.6; 12 -1.27,2.6; 13 -2.54,2.6; 14 -3.81,2.6
POWER_16_SHROUDED = drill 1.016 pad 1.88 square: 1 -8.89,-1.27 | drill 1.016 pad 1.88: 2 -8.89,1.27; 3 -6.35,-1.27; 4 -6.35,1.27; 5 -3.81,-1.27; 6 -3.81,1.27; 7 -1.27,-1.27; 8 -1.27,1.27; 9 1.27,-1.27; 10 1.27,1.27; 11 3.81,-1.27; 12 3.81,1.27; 13 6.35,-1.27; 14 6.35,1.27; 15 8.89,-1.27; 16 8.89,1.27
SOT23-BEC = smd 1 x 1.4: B -0.95,-1.1; C 0,1.1; E 0.95,-1.1
R0603 = smd 0.889 x 0.889: 1 -0.762,0; 2 0.762,0
C0805 = smd 1.016 x 1.397: 1 -0.889,0; 2 0.889,0
SOIC127P620X175-16N = smd 1.981 x 0.559: 1 -2.464,4.445; 2 -2.464,3.175; 3 -2.464,1.905; 4 -2.464,0.635; 5 -2.464,-0.635; 6 -2.464,-1.905; 7 -2.464,-3.175; 8 -2.464,-4.445; 9 2.464,-4.445; 10 2.464,-3.175; 11 2.464,-1.905; 12 2.464,-0.635; 13 2.464,0.635; 14 2.464,1.905; 15 2.464,3.175; 16 2.464,4.445
3.5MM-JACK-SWITCH-13MM-INPUT = drill 0.8 pad 1.93 long: RING@3 -3.7,0; SECOND@3 0,-3.5; SWITCH@3 3.7,0; TIP@3 0,4.5
3.5MM-JACK-SWITCH-13MM-OUTPUT = drill 0.8 pad 1.93 long: RING@3 -3.7,0; SECOND@3 0,-3.5; SWITCH@3 3.7,0; TIP@3 0,4.5
OG-POTS_ALPS_POT_VERTICAL = drill 1 pad 1.88: P$1 -2.58,-6.7; P$2 0,-6.7; P$3 2.58,-6.7 | drill 2.2 pad 3.175: P$4 4.4,0; P$5 -4.4,0
TC33X = smd 1.2 x 1.2: 1 -1,-1.825; 3 1,-1.825 | smd 1.5 x 1.6: 2 0,1.5

### Placement (x,y rotation side)
C1  -30.85,46.48 180 top  (outside the outline)
C2  -42.28,42.55 180 top  (outside the outline)
C3  -42.16,24.13 90 top  (outside the outline)
C4  -49.01,39.12 90 top  (outside the outline)
C5  -36.06,23.88 90 top  (outside the outline)
C6  -40.12,35.05 90 top  (outside the outline)
C7  -41.14,45.85 90 top  (outside the outline)
C8  -37.71,35.94 0 top  (outside the outline)
C9  -42.92,34.29 0 top  (outside the outline)
C10  -44.31,24.89 0 top  (outside the outline)
C11  -32.63,30.86 90 top  (outside the outline)
C12  -30.09,23.24 90 top  (outside the outline)
C13  -38.09,23.24 0 top  (outside the outline)
C14  -31.87,44.45 90 top  (outside the outline)
C15  43.06,-82.42 0 top  (outside the outline)
C16  46.11,-82.42 0 top  (outside the outline)
C17  49.16,-82.42 0 top  (outside the outline)
C18  52.2,-82.42 0 top  (outside the outline)
C19  55.25,-82.42 0 top  (outside the outline)
C20  58.3,-82.42 0 top  (outside the outline)
C21  77.22,63.31 270 top  (outside the outline)
C22  90.56,56.58 270 top  (outside the outline)
C23  22.36,-74.17 0 top  (outside the outline)
C24  29.85,-65.28 0 top  (outside the outline)
C25  96.08,77.15 90 top  (outside the outline)
C26  100.85,74.68 90 top  (outside the outline)
C27  94.18,76.96 90 top  (outside the outline)
C28  98.94,75.12 90 top  (outside the outline)
C29  65.48,95.63 270 top  (outside the outline)
C30  79.19,66.36 270 top  (outside the outline)
C31  94.37,52.64 270 top  (outside the outline)
C32  64.21,72.9 270 top  (outside the outline)
C33  65.48,66.8 270 top  (outside the outline)
C34  76.08,101.22 90 top  (outside the outline)
D1  -32.88,23.24 90 top  (outside the outline)
D2  -29.96,29.59 90 top  (outside the outline)
D7  29.6,-82.93 0 top  (outside the outline)
D8  37.35,-82.93 0 top  (outside the outline)
D_1NEG  3.31,64.77 0 top
D_1POS  8.39,64.77 0 top
D_2NEG  55.38,71.12 180 top
D_2POS  55.38,66.04 180 top
IC1  -36.57,44.45 270 top  (outside the outline)
IC2  -44.31,29.72 180 top  (outside the outline)
IC3  -38.22,29.72 180 top  (outside the outline)
IC4  -7.36,-5.21 0 top  (outside the outline)
IC5  -0.5,-74.42 0 top  (outside the outline)
IC6  12.2,-74.42 0 top  (outside the outline)
IC7  69.1,101.09 270 top  (outside the outline)
IC8  84.72,54.74 90 top  (outside the outline)
IC9  70.43,66.93 90 top  (outside the outline)
IC10  71.38,76.26 90 top  (outside the outline)
J1  30.36,4.57 180 bottom
Q1  41.16,-73.03 0 top  (outside the outline)
Q2  58.55,-73.03 0 top  (outside the outline)
R1  -42.41,45.85 90 top  (outside the outline)
R2  -32,61.98 0 top  (outside the outline)
R3  -32,60.07 0 top  (outside the outline)
R4  -45.33,82.93 270 top  (outside the outline)
R5  -30.09,82.93 270 top  (outside the outline)
R6  -44.57,42.29 270 top  (outside the outline)
R7  -45.46,45.72 270 top  (outside the outline)
R8  -42.92,35.56 0 top  (outside the outline)
R9  -44.31,23.37 0 top  (outside the outline)
R10  -45.97,20.7 270 top  (outside the outline)
R11  -42.28,43.81 0 top  (outside the outline)
R12  -37.71,34.54 0 top  (outside the outline)
R13  -40,20.83 270 top  (outside the outline)
R14  -41.39,20.83 270 top  (outside the outline)
R15  -40.12,23.88 270 top  (outside the outline)
R16  -38.09,24.64 180 top  (outside the outline)
R17  -36.95,20.83 270 top  (outside the outline)
R18  -37.97,39.12 90 top  (outside the outline)
R19  -30.6,44.45 270 top  (outside the outline)
R20  -30.85,42.42 180 top  (outside the outline)
R21  -30.34,39.12 90 top  (outside the outline)
R22  -7.99,-11.81 0 top  (outside the outline)
R23  -7.99,-14.35 0 top  (outside the outline)
R24  62.24,-82.8 0 top  (outside the outline)
R25  66.43,-82.8 0 top  (outside the outline)
R26  70.62,-82.8 0 top  (outside the outline)
R27  74.81,-82.8 0 top  (outside the outline)
R28  79,-82.8 0 top  (outside the outline)
R29  -32.25,-84.96 0 top  (outside the outline)
R30  -14.34,-88.14 0 top  (outside the outline)
R31  -10.15,-88.14 0 top  (outside the outline)
R32  -5.96,-88.14 0 top  (outside the outline)
R33  -1.77,-88.14 0 top  (outside the outline)
R34  2.42,-88.14 0 top  (outside the outline)
R35  6.61,-88.14 0 top  (outside the outline)
R36  10.8,-88.14 0 top  (outside the outline)
R37  14.99,-88.14 0 top  (outside the outline)
R38  19.18,-88.14 0 top  (outside the outline)
R39  23.38,-88.14 0 top  (outside the outline)
R40  27.57,-88.14 0 top  (outside the outline)
R41  31.76,-88.14 0 top  (outside the outline)
R42  35.95,-88.14 0 top  (outside the outline)
R43  40.14,-88.14 0 top  (outside the outline)
R44  44.33,-88.14 0 top  (outside the outline)
R45  48.52,-88.14 0 top  (outside the outline)
R46  52.71,-88.14 0 top  (outside the outline)
R47  56.9,-88.14 0 top  (outside the outline)
R48  61.09,-88.14 0 top  (outside the outline)
R49  65.29,-88.14 0 top  (outside the outline)
R50  67.76,87.31 0 top  (outside the outline)
R51  61.73,101.22 90 top
R52  63.44,91.76 0 top  (outside the outline)
R53  66.94,91.76 180 top  (outside the outline)
R54  70.75,62.87 180 top  (outside the outline)
R55  82.69,67.94 270 top  (outside the outline)
R56  80.78,66.36 270 top  (outside the outline)
R57  63.32,101.41 90 top  (outside the outline)
R58  67.38,104.46 0 top  (outside the outline)
R59  86.5,79.57 270 top  (outside the outline)
R60  92.21,53.02 270 top  (outside the outline)
R61  79.19,55.05 270 top  (outside the outline)
R62  85.48,50.48 180 top  (outside the outline)
R63  64.91,46.35 180 top  (outside the outline)
R64  64.27,68.64 90 top  (outside the outline)
R65  64.27,65.47 270 top  (outside the outline)
R66  65.6,41.27 180 top  (outside the outline)
R67  50.94,71.95 90 top
R68  74.11,101.16 270 top  (outside the outline)
R69  75.76,95.89 90 top  (outside the outline)
R70  58.62,66.29 90 top
R71  79.45,74.1 270 top  (outside the outline)
R72  81.35,76.07 270 top  (outside the outline)
U1  30.61,-39.37 0 top  (outside the outline)
U$1  -0.5,0 0 top
U$2  5.85,100.33 0 top
U$3  18.55,53.34 0 top
U$4  5.85,53.34 0 top
U$5  5.85,40.64 0 top
U$6  19.82,100.33 0 top
U$7  19.82,86.36 0 top
U$8  19.82,69.85 0 top
U$9  54.11,100.33 0 top
U$12  5.85,20.32 0 top
U$13  5.85,87.63 0 top
U$14  19.82,13.97 0 top
U$15  54.11,20.32 0 top
U$16  40.14,13.97 0 top
U$17  21.09,38.1 0 top
U$18  5.85,6.35 0 top
U$19  54.11,6.35 0 top
U$20  54.11,53.34 0 top
U$21  -21.84,-74.8 0 top  (outside the outline)
U$22  -17.26,-83.19 0 top  (outside the outline)
U$23  -9.9,-83.19 0 top  (outside the outline)
U$24  -2.53,-83.19 0 top  (outside the outline)
U$25  54.11,87.63 0 top
U$26  41.41,53.34 0 top
U$27  54.11,40.64 0 top
U$28  40.14,100.33 0 top
U$29  40.14,69.85 0 top
U$30  38.87,38.1 0 top
U$31  40.14,86.36 0 top

### Tracks (layer width: path | path; a pad name or v marks a point on that pad's centre or on a via)
12V  (27 unrouted)
-12V  (25 unrouted)
CV_IN_A  (1 unrouted)
CV_IN_B  (1 unrouted)
GND  (44 unrouted)
  pour Bottom: 62.3,110.05 -4.31,108.71 -3.67,-4.32 64.97,-5.27
N$1  (1 unrouted)
N$2  (3 unrouted)
N$3  (2 unrouted)
N$4  (2 unrouted)
N$5  (3 unrouted)
N$6  (1 unrouted)
N$7  (6 unrouted)
N$8  (3 unrouted)
N$9  (3 unrouted)
N$10  (2 unrouted)
N$11  (3 unrouted)
N$12  (1 unrouted)
N$14  (6 unrouted)
N$15  (1 unrouted)
N$16  (1 unrouted)
N$17  (3 unrouted)
N$18  (3 unrouted)
N$19  (1 unrouted)
N$20  (1 unrouted)
N$21  (1 unrouted)
N$22  (1 unrouted)
N$23  (1 unrouted)
N$24  (4 unrouted)
N$25  (3 unrouted)
N$26  (1 unrouted)
N$27  (2 unrouted)
N$28  (2 unrouted)
N$29  (1 unrouted)
N$30  (1 unrouted)
N$31  (1 unrouted)
N$32  (2 unrouted)
N$33  (1 unrouted)
N$34  (1 unrouted)
N$35  (1 unrouted)
N$36  (1 unrouted)
N$37  (1 unrouted)
N$38  (1 unrouted)
N$39  (2 unrouted)
N$40  (2 unrouted)
N$41  (2 unrouted)
N$42  (2 unrouted)
N$43  (2 unrouted)
N$44  (2 unrouted)
N$45  (2 unrouted)
N$46  (2 unrouted)
N$47  (1 unrouted)
N$48  (1 unrouted)
N$50  (2 unrouted)
N$51  (2 unrouted)
N$52  (3 unrouted)
N$53  (3 unrouted)
N$54  (1 unrouted)
N$55  (2 unrouted)
N$56  (2 unrouted)
N$57  (3 unrouted)
N$58  (2 unrouted)
N$59  (2 unrouted)
N$60  (2 unrouted)
N$62  (2 unrouted)
N$63  (1 unrouted)
N$64  (2 unrouted)
N$65  (6 unrouted)
N$66  (1 unrouted)
N$67  (6 unrouted)
N$68  (3 unrouted)
N$69  (1 unrouted)
N$70  (2 unrouted)
N$71  (3 unrouted)
N$72  (3 unrouted)
N$73  (3 unrouted)
N$75  (1 unrouted)
N$76  (1 unrouted)
N$77  (3 unrouted)
N$78  (3 unrouted)
N$79  (1 unrouted)
N$80  (1 unrouted)
N$81  (4 unrouted)
N$82  (3 unrouted)
N$83  (1 unrouted)
N$84  (1 unrouted)
N$85  (2 unrouted)
N$86  (2 unrouted)
OUTPUT1_SUM_TO_VCA1  (5 unrouted)
OUTPUT2_SUM_TO_VCA2  (5 unrouted)
TRANS_OUT_A  (2 unrouted)
TRANS_OUT_B  (2 unrouted)
V+  (1 unrouted)
V-  (1 unrouted)